# EAGLE design v1 (EAGLE 9.0.1)
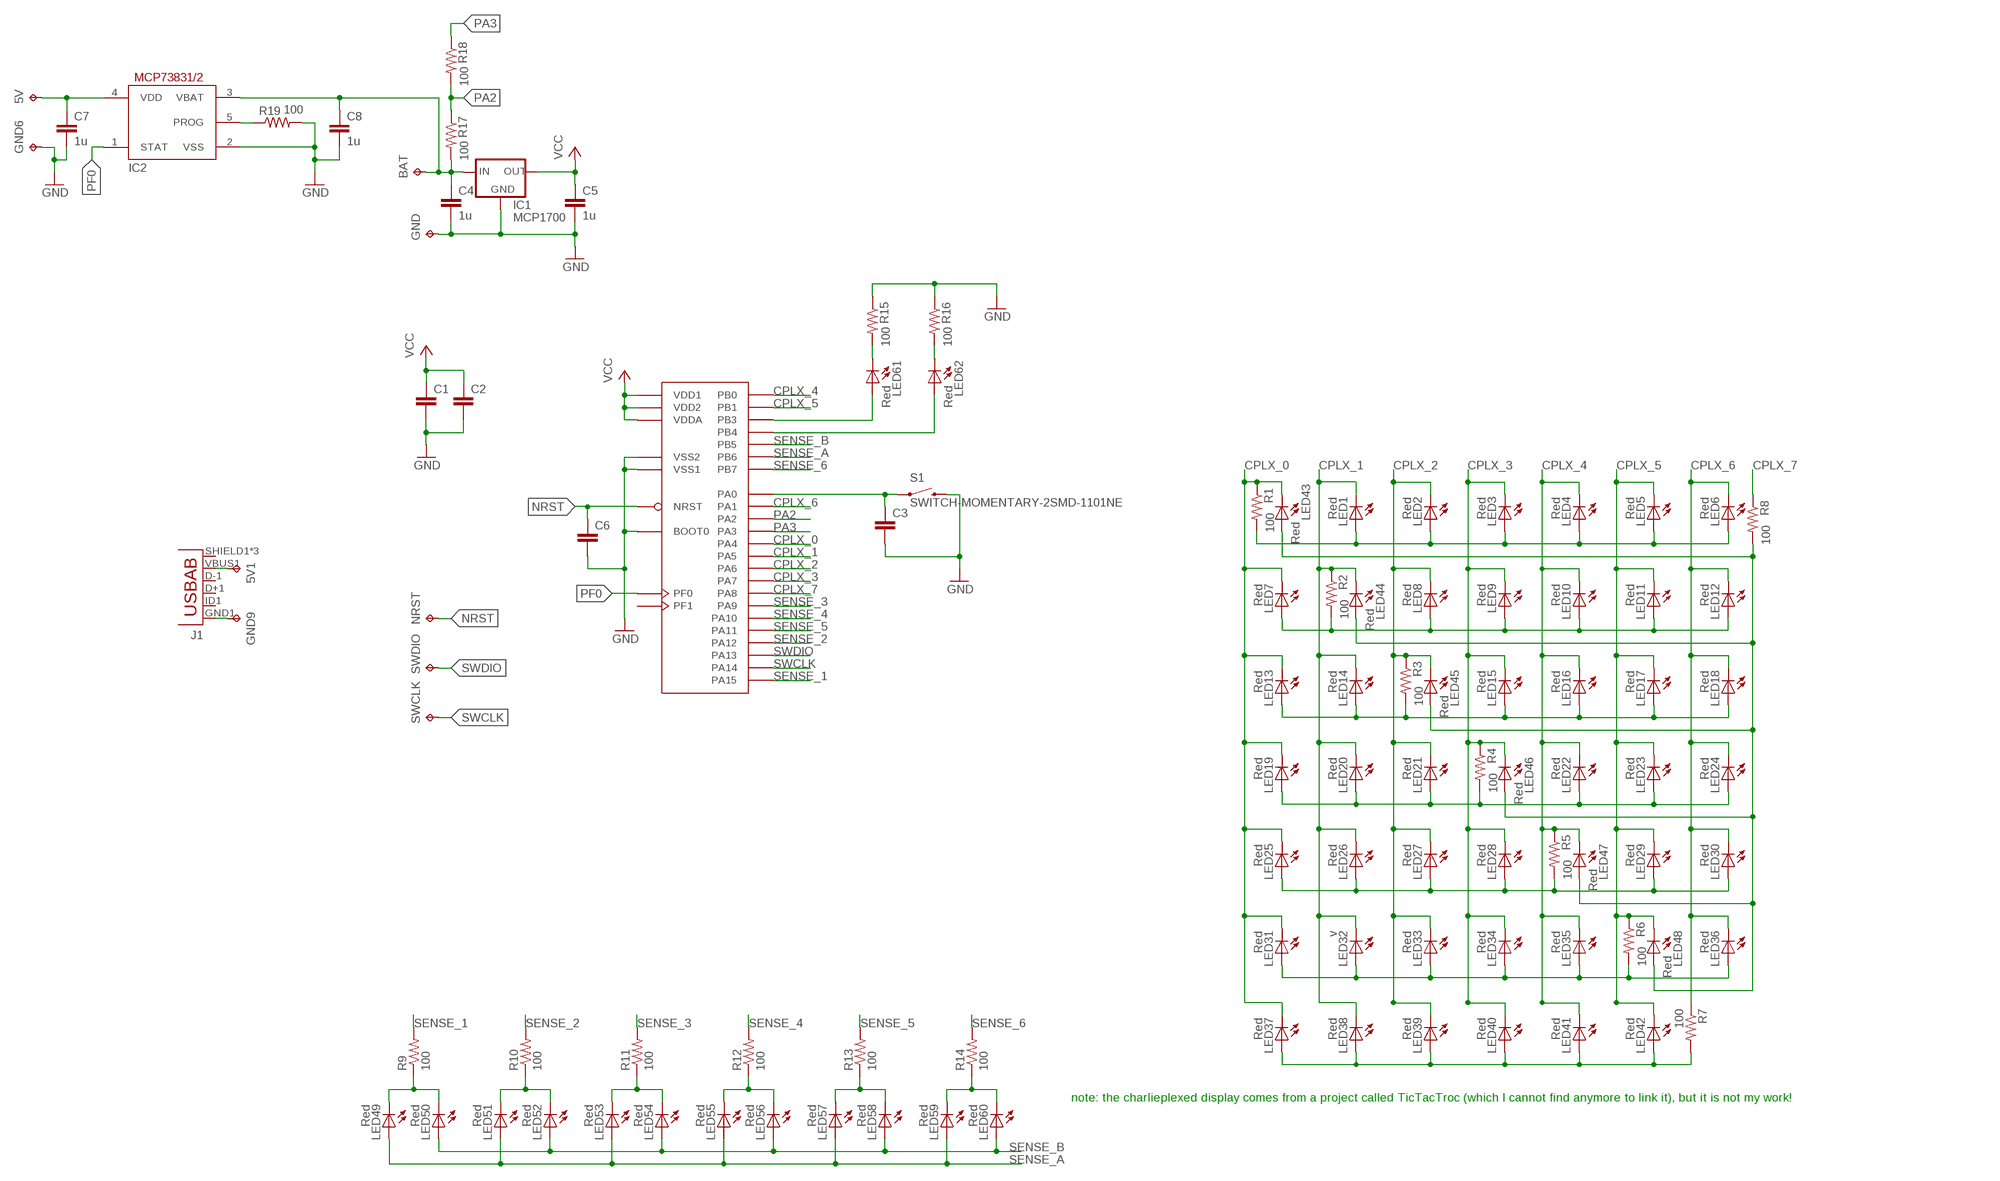
[diagram p0: schematic, sheet 1]

## Parts
5V  TPB1,27  [B1,27]
5V1  TPB1,27  [B1,27]
BAT  TPB1,27  [B1,27]
C1  C-EUC0603K  [C0603K]
C2  C-EUC0603K  [C0603K]
C3  C-EUC0603K  [C0603K]
C4  1u  C-EUC0603K  [C0603K]
C5  1u  C-EUC0603K  [C0603K]
C6  C-EUC0603K  [C0603K]
C7  1u  C-EUC0603K  [C0603K]
C8  1u  C-EUC0603K  [C0603K]
GND  TPB1,27  [B1,27]
GND6  TPB1,27  [B1,27]
GND9  TPB1,27  [B1,27]
IC1  MCP1700  XC63FPM  [SOT23]
IC2  MCP73831/OT  [SOT23-5L]
J1  USB-ABCONN-11794  [USB-AB-MICRO-SMD_V03]
LED1  Red  LED0603  [LED-0603]
LED2  Red  LED0603  [LED-0603]
LED3  Red  LED0603  [LED-0603]
LED4  Red  LED0603  [LED-0603]
LED5  Red  LED0603  [LED-0603]
LED6  Red  LED0603  [LED-0603]
LED7  Red  LED0603  [LED-0603]
LED8  Red  LED0603  [LED-0603]
LED9  Red  LED0603  [LED-0603]
LED10  Red  LED0603  [LED-0603]
LED11  Red  LED0603  [LED-0603]
LED12  Red  LED0603  [LED-0603]
LED13  Red  LED0603  [LED-0603]
LED14  Red  LED0603  [LED-0603]
LED15  Red  LED0603  [LED-0603]
LED16  Red  LED0603  [LED-0603]
LED17  Red  LED0603  [LED-0603]
LED18  Red  LED0603  [LED-0603]
LED19  Red  LED0603  [LED-0603]
LED20  Red  LED0603  [LED-0603]
LED21  Red  LED0603  [LED-0603]
LED22  Red  LED0603  [LED-0603]
LED23  Red  LED0603  [LED-0603]
LED24  Red  LED0603  [LED-0603]
LED25  Red  LED0603  [LED-0603]
LED26  Red  LED0603  [LED-0603]
LED27  Red  LED0603  [LED-0603]
LED28  Red  LED0603  [LED-0603]
LED29  Red  LED0603  [LED-0603]
LED30  Red  LED0603  [LED-0603]
LED31  Red  LED0603  [LED-0603]
LED32  v  LED0603  [LED-0603]
LED33  Red  LED0603  [LED-0603]
LED34  Red  LED0603  [LED-0603]
LED35  Red  LED0603  [LED-0603]
LED36  Red  LED0603  [LED-0603]
LED37  Red  LED0603  [LED-0603]
LED38  Red  LED0603  [LED-0603]
LED39  Red  LED0603  [LED-0603]
LED40  Red  LED0603  [LED-0603]
LED41  Red  LED0603  [LED-0603]
LED42  Red  LED0603  [LED-0603]
LED43  Red  LED0603  [LED-0603]
LED44  Red  LED0603  [LED-0603]
LED45  Red  LED0603  [LED-0603]
LED46  Red  LED0603  [LED-0603]
LED47  Red  LED0603  [LED-0603]
LED48  Red  LED0603  [LED-0603]
LED49  Red  LED0603  [LED-0603]
LED50  Red  LED0603  [LED-0603]
LED51  Red  LED0603  [LED-0603]
LED52  Red  LED0603  [LED-0603]
LED53  Red  LED0603  [LED-0603]
LED54  Red  LED0603  [LED-0603]
LED55  Red  LED0603  [LED-0603]
LED56  Red  LED0603  [LED-0603]
LED57  Red  LED0603  [LED-0603]
LED58  Red  LED0603  [LED-0603]
LED59  Red  LED0603  [LED-0603]
LED60  Red  LED0603  [LED-0603]
LED61  Red  LED0603  [LED-0603]
LED62  Red  LED0603  [LED-0603]
NRST  TPB1,27  [B1,27]
R1  100  RESISTOR0402-RES  [0402-RES]
R2  100  RESISTOR0402-RES  [0402-RES]
R3  100  RESISTOR0402-RES  [0402-RES]
R4  100  RESISTOR0402-RES  [0402-RES]
R5  100  RESISTOR0402-RES  [0402-RES]
R6  100  RESISTOR0402-RES  [0402-RES]
R7  100  RESISTOR0402-RES  [0402-RES]
R8  100  RESISTOR0402-RES  [0402-RES]
R9  100  RESISTOR0402-RES  [0402-RES]
R10  100  RESISTOR0402-RES  [0402-RES]
R11  100  RESISTOR0402-RES  [0402-RES]
R12  100  RESISTOR0402-RES  [0402-RES]
R13  100  RESISTOR0402-RES  [0402-RES]
R14  100  RESISTOR0402-RES  [0402-RES]
R15  100  RESISTOR0402-RES  [0402-RES]
R16  100  RESISTOR0402-RES  [0402-RES]
R17  100  RESISTOR0402-RES  [0402-RES]
R18  100  RESISTOR0402-RES  [0402-RES]
R19  100  RESISTOR0402-RES  [0402-RES]
S1  SWITCH-MOMENTARY-2SMD-1101NE  [TACTILE-SWITCH-1101NE]
SWCLK  TPB1,27  [B1,27]
SWDIO  TPB1,27  [B1,27]
U$1  STM32F030K6T6  [TQFP32-08]

## Nets
CPLX_0: LED7.C LED13.C LED19.C LED25.C LED31.C LED37.C LED43.C R1.1 U$1.10(PA4)
CPLX_1: LED1.C LED14.C LED20.C LED26.C LED32.C LED38.C LED44.C R2.1 U$1.11(PA5)
CPLX_2: LED2.C LED8.C LED21.C LED27.C LED33.C LED39.C LED45.C R3.1 U$1.12(PA6)
CPLX_3: LED3.C LED9.C LED15.C LED28.C LED34.C LED40.C LED46.C R4.1 U$1.13(PA7)
CPLX_4: LED4.C LED10.C LED16.C LED22.C LED35.C LED41.C LED47.C R5.1 U$1.14(PB0)
CPLX_5: LED5.C LED11.C LED17.C LED23.C LED29.C LED42.C LED48.C R6.1 U$1.15(PB1)
CPLX_6: LED6.C LED12.C LED18.C LED24.C LED30.C LED36.C R7.1 U$1.7(PA1)
CPLX_7: R8.1 U$1.18(PA8)
GND: C1.2 C2.2 C3.2 C4.2 C5.2 C6.2 C7.2 C8.2 GND6.TP GND.TP IC1.1(GND) IC2.2(VSS) R15.1 R16.1 R19.2 S1.2 U$1.16(VSS1) U$1.31(BOOT0) U$1.32(VSS2)
N$1: LED61.A U$1.26(PB3)
N$2: LED62.A U$1.27(PB4)
N$3: GND9.TP J1.GND1(GND)
N$4: C3.1 S1.1 U$1.6(PA0)
N$5: LED61.C R15.2
N$6: LED62.C R16.2
N$7: 5V1.TP J1.VBUS1(VBUS)
N$8: 5V.TP C7.1 IC2.4(VDD)
N$9: IC2.5(PROG) R19.1
N$11: BAT.TP C4.1 C8.1 IC1.3(IN) IC2.3(VBAT) R17.2
N$12: LED19.A LED20.A LED21.A LED22.A LED23.A LED24.A R4.2
N$13: LED1.A LED2.A LED3.A LED4.A LED5.A LED6.A R1.2
N$14: LED7.A LED8.A LED9.A LED10.A LED11.A LED12.A R2.2
N$15: LED25.A LED26.A LED27.A LED28.A LED29.A LED30.A R5.2
N$16: LED13.A LED14.A LED15.A LED16.A LED17.A LED18.A R3.2
N$17: LED43.A LED44.A LED45.A LED46.A LED47.A LED48.A R8.2
N$18: LED37.A LED38.A LED39.A LED40.A LED41.A LED42.A R7.2
N$19: LED31.A LED32.A LED33.A LED34.A LED35.A LED36.A R6.2
N$21: LED49.C LED50.C R9.1
N$22: LED51.C LED52.C R10.1
N$23: LED53.C LED54.C R11.1
N$24: LED55.C LED56.C R12.1
N$25: LED57.C LED58.C R13.1
N$26: LED59.C LED60.C R14.1
NRST: C6.1 NRST.TP U$1.4(NRST)
PA2: R17.1 R18.2 U$1.8(PA2)
PA3: R18.1 U$1.9(PA3)
PF0: IC2.1(STAT) U$1.2(PF0)
SENSE_1: R9.2 U$1.25(PA15)
SENSE_2: R10.2 U$1.22(PA12)
SENSE_3: R11.2 U$1.19(PA9)
SENSE_4: R12.2 U$1.20(PA10)
SENSE_5: R13.2 U$1.21(PA11)
SENSE_6: R14.2 U$1.30(PB7)
SENSE_A: LED49.A LED51.A LED53.A LED55.A LED57.A LED59.A U$1.29(PB6)
SENSE_B: LED50.A LED52.A LED54.A LED56.A LED58.A LED60.A U$1.28(PB5)
SWCLK: SWCLK.TP U$1.24(PA14)
SWDIO: SWDIO.TP U$1.23(PA13)
VCC: C1.1 C2.1 C5.1 IC1.2(OUT) U$1.1(VDD1) U$1.5(VDDA) U$1.17(VDD2)
Unconnected: J1.D+1(D+) J1.D-1(D-) J1.ID1(USBID) J1.SHIELD1(SHIELD) J1.SHIELD2(SHIELD) J1.SHIELD3(SHIELD) U$1.3(PF1)

## Notes on the sheet
- note: the charlieplexed display comes from a project called TicTacTroc (which I cannot find anymore to link it), but it is not my work!

## Library data of the parts
5V 5V1 BAT GND GND6 GND9 NRST SWCLK SWDIO = testpad:TP: Test pad
C1-C8 = resistor:C-EU: CAPACITOR, European symbol
IC1 = v-reg:XC63FP: Positiv Voltage Regulators www.torex.co.jp/english/product/pro02/pdf/0201_xc62fp.pdf
IC2 = adafruit:MCP73831: MCP73831/2 Miniature Single-Cell, Fully Integrated Li-Ion, Li-Polymer Charge Management Controllers. Nice and small simple lipoly charge controller, with adjustable current and status output (LED) http://www.ladyada.net/library/pcb/eaglelibrary.html
J1 = SparkFun-Connectors:USB-AB: This is a USB AB connector that is compatible with USB OTG. i.e. this connector can serve as a host or device; PROD_ID: CONN-11794
LED1-LED62 = SparkFun:LED: LEDs Standard schematic elements and footprints for 5mm, 3mm, 1206, and 0603 sized LEDs. 5mm - Spark Fun Electronics SKU : COM-00529 (and others)
R1-R19 = SparkFun:RESISTOR: Resistor Basic schematic elements and footprints for 0603, 1206, and PTH resistors.
S1 = SparkFun-Electromechanical:SWITCH-MOMENTARY-2: Various NO switches- pushbuttons, reed, etc; PROD_ID: SWCH-00815
U$1 = SparkFun-DigitalIC:STM32F030K6T6

## Board
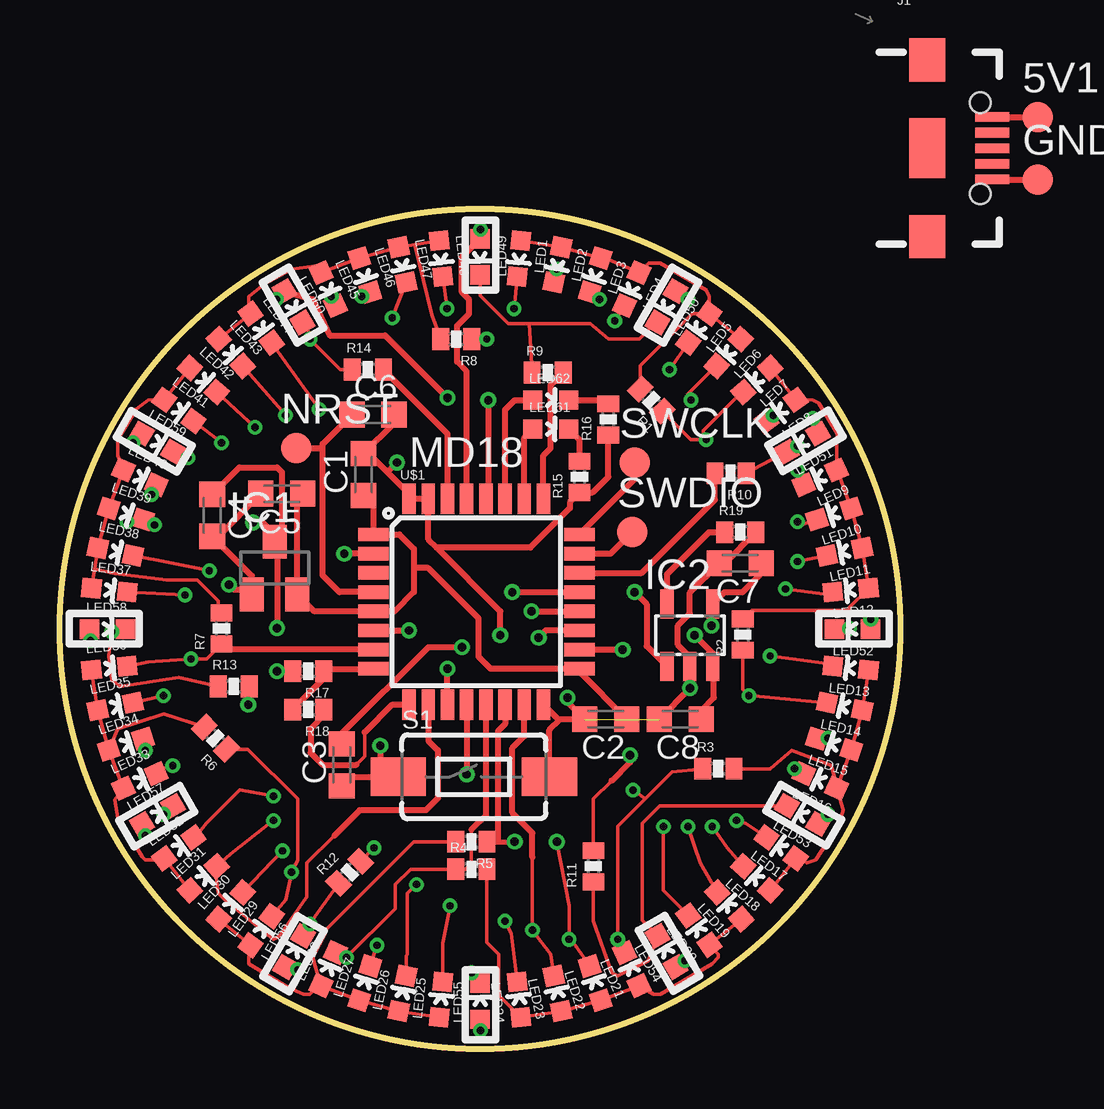
[diagram p1: board, top side]
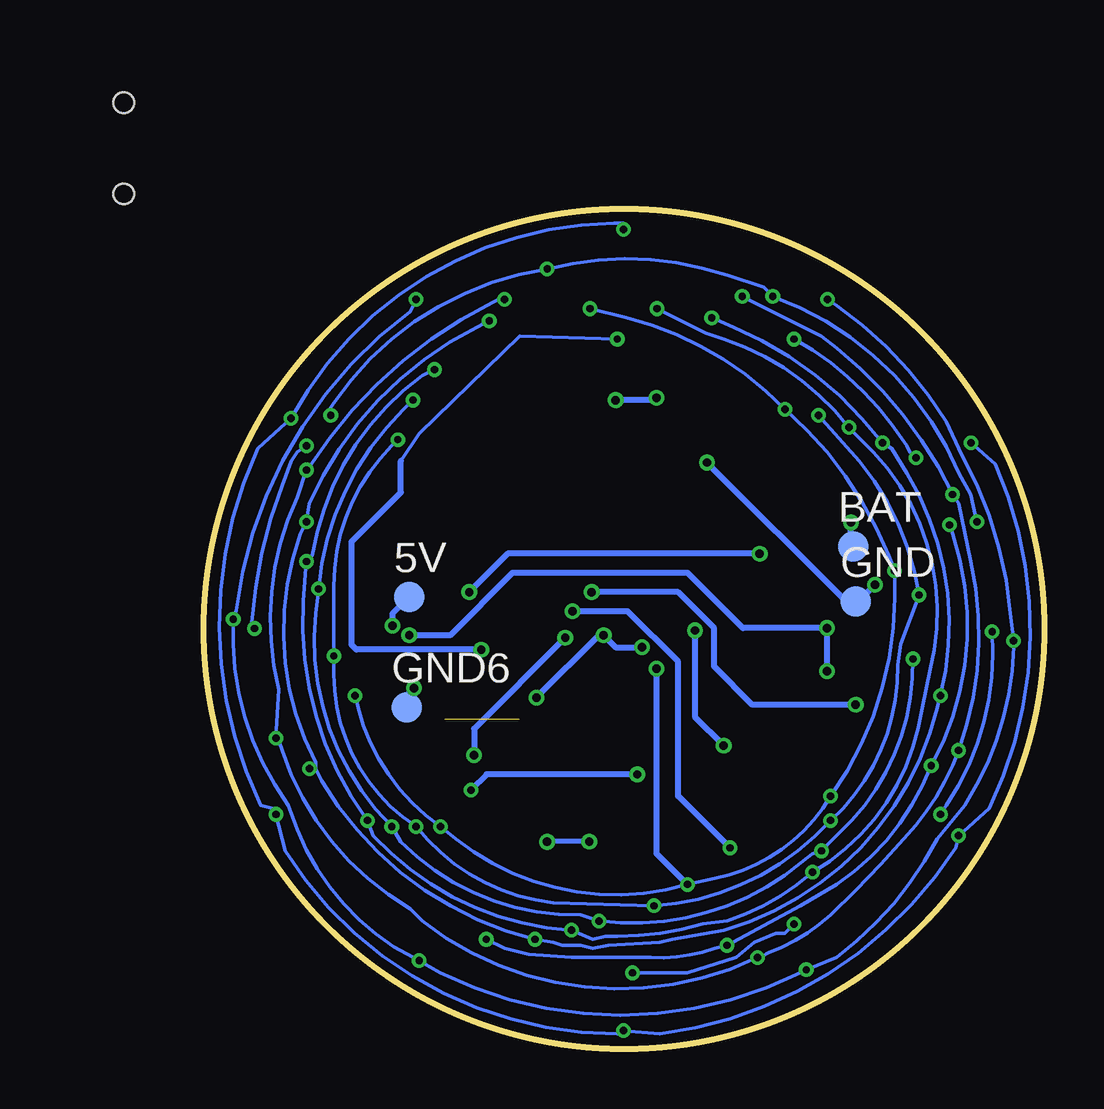
[diagram p2: board, bottom side, seen from below]

Size 35 x 35 mm. Coordinates in mm from the lower left corner, seen from the top.
Outline: circle at 17.5,17.5 radius 17.5
Copper layers (1*16): Top 0.035mm / dielectric 1.5mm / Bottom 0.035mm
Design rules "default": minimum track width 6mil, minimum drill 12mil, track to track 6mil, track to pad 6mil, pad to pad 6mil, via to via 6mil, smd to smd 0mil, copper to edge 10mil, drill to drill 10mil, minimum pad ring 10mil, minimum via ring 6mil, stop-mask expansion 2mil, vias tented up to drill 100mil, thermal gap 10mil

### Footprints (pad centres in the part's own frame; a part is rotated, then mirrored left to right if it is on the bottom)
B1,27 = smd 1.27 x 1.27: TP 0,0
C0603K = smd 1.05 x 1.08: 1 -0.875,0; 2 0.875,0
SOT23 = smd 1 x 1.4: 1 -0.95,-1.1; 2 0.95,-1.1; 3 0,1.1
SOT23-5L = smd 0.55 x 1.2: 1 -0.95,-1.3; 2 0,-1.3; 3 0.95,-1.3; 4 0.95,1.3; 5 -0.95,1.3
USB-AB-MICRO-SMD_V03 = smd 1.4 x 0.4: D+1 2.7,0; D-1 2.7,0.65; GND1 2.7,-1.3; ID1 2.7,-0.65; VBUS1 2.7,1.3 | smd 1.5 x 1.8: SHIELD1 0,3.68; SHIELD3 0,-3.68 | smd 1.5 x 2.5: SHIELD2 0,0 | hole 0.85: 2.2,1.9; 2.2,-1.9
LED-0603 = smd 0.8 x 0.8: A 0,-0.75; C 0,0.75
0402-RES = smd 0.7 x 0.9: 1 -0.65,0; 2 0.65,0
TACTILE-SWITCH-1101NE = smd 2.3 x 1.6: 1 -3.15,0; 2 3.15,0
TQFP32-08 = smd 1.27 x 0.559: 1 -4.293,2.8; 2 -4.293,2; 3 -4.293,1.2; 4 -4.293,0.4; 5 -4.293,-0.4; 6 -4.293,-1.2; 7 -4.293,-2; 8 -4.293,-2.8; 17 4.293,-2.8; 18 4.293,-2; 19 4.293,-1.2; 20 4.293,-0.4; 21 4.293,0.4; 22 4.293,1.2; 23 4.293,2; 24 4.293,2.8 | smd 0.559 x 1.27: 9 -2.8,-4.293; 10 -2,-4.293; 11 -1.2,-4.293; 12 -0.4,-4.293; 13 0.4,-4.293; 14 1.2,-4.293; 15 2,-4.293; 16 2.8,-4.293; 25 2.8,4.293; 26 2,4.293; 27 1.2,4.293; 28 0.4,4.293; 29 -0.4,4.293; 30 -1.2,4.293; 31 -2,4.293; 32 -2.8,4.293

### Placement (x,y rotation side)
5V  26.45,18.85 0 bottom
5V1  40.75,38.85 0 top  (outside the outline)
BAT  7.95,20.95 0 bottom
C1  12.65,23.95 90 top
C2  22.75,13.75 180 top
C3  11.75,11.85 90 top
C4  6.35,22.25 270 top
C5  9.25,23.15 180 top
C6  13.05,26.45 0 top
C7  28.35,20.25 180 top
C8  25.85,13.75 180 top
GND  7.85,18.65 0 bottom
GND6  26.55,14.25 0 bottom
GND9  40.75,36.25 0 top  (outside the outline)
IC1  8.95,20.05 0 top
IC2  26.25,17.25 0 top
J1  36.15,37.55 0 top
LED1  19.13,32.94 174 top
LED2  20.73,32.69 168 top
LED3  22.3,32.26 162 top
LED4  23.82,31.67 156 top
LED5  26.62,30.05 144 top
LED6  27.86,29.03 138 top
LED7  29.03,27.89 132 top
LED8  30.05,26.62 126 top
LED9  31.67,23.82 114 top
LED10  32.26,22.3 108 top
LED11  32.69,20.73 102 top
LED12  32.94,19.13 96 top
LED13  32.94,15.87 84 top
LED14  32.69,14.27 78 top
LED15  32.26,12.7 72 top
LED16  31.67,11.18 66 top
LED17  30.05,8.38 54 top
LED18  29.03,7.11 48 top
LED19  27.89,5.97 42 top
LED20  26.62,4.95 36 top
LED21  23.82,3.33 24 top
LED22  22.3,2.74 18 top
LED23  20.73,2.31 12 top
LED24  19.13,2.06 6 top
LED25  15.87,2.06 354 top
LED26  14.27,2.31 348 top
LED27  12.7,2.74 342 top
LED28  11.18,3.33 336 top
LED29  8.38,4.93 324 top
LED30  7.11,5.97 318 top
LED31  5.97,7.11 312 top
LED32  4.95,8.38 306 top
LED33  3.33,11.18 294 top
LED34  2.74,12.7 288 top
LED35  2.31,14.27 282 top
LED36  2.06,15.87 276 top
LED37  2.06,19.13 264 top
LED38  2.31,20.73 258 top
LED39  2.74,22.3 252 top
LED40  3.33,23.82 246 top
LED41  4.95,26.62 234 top
LED42  5.97,27.89 228 top
LED43  7.11,29.03 222 top
LED44  8.38,30.05 216 top
LED45  11.18,31.67 204 top
LED46  12.7,32.26 198 top
LED47  14.27,32.69 192 top
LED48  15.87,32.94 186 top
LED49  17.5,33.02 180 top
LED50  25.27,30.94 150 top
LED51  30.94,25.27 120 top
LED52  33.02,17.5 90 top
LED53  30.94,9.75 60 top
LED54  25.27,4.06 30 top
LED55  17.5,1.98 0 top
LED56  9.75,4.06 330 top
LED57  4.06,9.75 300 top
LED58  1.98,17.5 270 top
LED59  4.06,25.27 240 top
LED60  9.73,30.94 210 top
LED61  20.45,25.85 270 top
LED62  20.45,27.05 270 top
NRST  9.85,25.05 0 top
R1  24.64,27.05 135 top
R2  28.45,17.27 90 top
R3  27.43,11.68 0 top
R4  17.14,7.49 0 top
R5  17.14,8.64 180 top
R6  6.48,12.95 135 top
R7  6.73,17.53 90 top
R8  16.51,29.59 180 top
R9  20.32,28.19 0 top
R10  27.94,24 180 top
R11  22.22,7.62 90 top
R12  12.06,7.37 45 top
R13  7.24,15.11 0 top
R14  12.83,28.32 0 top
R15  21.65,23.85 90 top
R16  22.85,26.25 90 top
R17  10.35,15.75 180 top
R18  10.35,14.15 180 top
R19  28.35,21.55 0 top
S1  17.25,11.35 0 top
SWCLK  23.95,24.45 0 top
SWDIO  23.85,21.55 0 top
U$1  17.35,18.65 0 top

### Tracks (layer width: path | path; a pad name or v marks a point on that pad's centre or on a via)
CPLX_0  (via drill 0.3)
  Top 0.152: LED7.C 28.4,27.39 26.8,25.78 26.8,25.53 v26.92,25.4 26.29,25.4 R1.1 | v29.59,16.38 32.38,16 32.26,16 LED13.C | v26.16,9.27 26.67,7.75 LED19.C | LED25.C 15.95,4.4 v16.26,5.97 | v8.89,9.52 7.11,8.13 LED31.C 6.48,7.49 6.6,6.48 6.86,6.22 8.89,4.57 9.14,4.7 10.29,6.35 10.29,7.75 11.43,8.89 | LED37.C v5.21,18.92 | LED43.C v9.4,26.42
  Top 0.254: U$1.10 15.35,12.85 15.75,12.45 15.75,10.45 15.25,9.95 12.49,9.95 11.43,8.89
  Bottom 0.152: v26.92,25.4 27.18,25.15 arc-45 29.59,19.3 v29.59,16.38 29.59,15.62 arc-57 v26.16,9.27 arc-46 20.45,6.1 v16.26,5.97 arc-44 v8.89,9.52 arc-49 6.1,16 5.97,16.89 v5.21,18.92 arc-36 8.38,25.27 v9.4,26.42
CPLX_1  (via drill 0.3, 0.35)
  Top 0.152: LED14.C v28.7,14.73 28.45,14.99 R2.1 | v25.15,9.27 25.15,6.6 26.18,5.57 LED20.C | v14.86,6.86 14.48,6.48 14.48,3.94 14.43,3.89 LED26.C | v8.89,10.54 7.49,10.79 6.1,9.4 5.59,8.76 | 5.59,8.76 5.59,8.89 | 5.59,8.76 LED32.C | LED38.C v6.22,19.94 | v10.79,26.67 8.89,29.34 | 8.89,29.34 8.89,29.46 | LED44.C 8.89,29.34 | LED1.C v18.92,30.86
  Top 0.254: U$1.11 v16.15,15.85
  Bottom 0.152: v28.7,14.73 28.57,14.22 arc-41 v25.15,9.27 24.51,8.76 arc-55 v14.86,6.86 13.72,7.11 arc-48 v8.89,10.54 arc-35 6.22,18.8 v6.22,19.94 6.48,20.57 arc-27 v10.79,26.67 arc-32 17.4,30.48 v18.92,30.86
  Bottom 0.254: v16.15,15.85 16.15,8.14 v14.86,6.86
CPLX_2  (via drill 0.3, 0.35)
  Top 0.152: LED27.C v13.21,4.32 | v4.7,11.81 4.7,11.94 3.94,11.43 LED33.C 4.08,11.53 | LED21.C v23.24,4.57 23.24,9.27 24.38,10.41 | LED39.C v3.94,21.84 v2.79,21.97 | LED8.C v29.72,26.42 | v20.7,32.51 20.83,32.51 20.57,32 LED2.C | LED45.C v11.3,31.37 | 24.38,10.41 25.51,11.56 R3.1 | 23.88,10.92 v23.88,10.79 24.38,10.41
  Top 0.254: U$1.12 v16.95,11.45
  Bottom 0.152: v23.24,4.57 22.48,4.19 21.46,3.94 19.68,3.81 16.38,3.81 arc-21 13.72,4.19 v13.21,4.32 10.16,5.97 8.64,6.86 arc-35 v4.7,11.81 arc-47 3.81,21.46 v3.94,21.84 | v29.72,26.42 29.84,26.54 29.59,26.92 arc47 v20.7,32.51 arc33 13.21,32.26 11.68,31.75 v11.3,31.37 arc47 3.56,24 3.05,23.11 v2.79,21.97
  Bottom 0.254: v16.95,11.45 23.22,11.45 v23.88,10.79
CPLX_3  (via drill 0.3)
  Top 0.152: LED3.C 22.22,31.24 v22.48,31.24 | v30.73,24.13 30.73,24 LED9.C | LED15.C v32,12.95 | LED28.C v11.94,3.81 13.97,5.84 13.97,6.86 14.6,7.49 R4.1 16.89,7.49 17.14,7.75 17.14,9.14 | LED34.C v3.56,12.45 | LED40.C v3.81,23.11 | LED46.C v12.57,31.37
  Top 0.254: U$1.13 17.75,9.74 17.14,9.14
  Bottom 0.152: v22.48,31.24 22.73,31.24 22.99,31.11 arc-31 30.61,24.26 v30.73,24.13 31.11,22.99 arc-39 31.88,14.99 v32,12.95 32,13.21 31.75,12.45 arc-41 26.42,5.84 25.91,5.33 arc-64 v11.94,3.81 arc-22 LED28.C arc-22 8.89,5.59 arc-6 5.84,8.76 arc-20 3.81,11.81 v3.56,12.45 arc-32 3.05,20.32 3.56,22.73 v3.81,23.11 arc-26 8.64,29.21 9.27,29.72 v12.57,31.37
CPLX_4  (via drill 0.3, 0.35)
  Top 0.152: LED4.C v23.11,30.35 | v30.73,21.97 30.86,21.84 LED10.C | LED16.C 30.99,11.68 v30.61,11.68 | LED22.C 21.46,4.32 v21.21,4.57 21.21,5.97 v20.7,8.64 | LED35.C v4.32,14.73 | LED41.C v6.73,25.27 | LED47.C v13.84,30.48 | 18.25,8.64 R5.1
  Top 0.2: R5.1 v18.94,8.64 v18.95,8.65
  Top 0.254: U$1.14 18.55,13.55 18.25,13.25 18.25,8.64
  Bottom 0.152: v23.11,30.35 23.62,30.1 arc-40 30.61,22.73 v30.73,21.97 30.99,21.46 arc-47 30.35,11.94 30.35,11.68 | v30.61,11.68 30.35,11.68 | 30.35,11.68 30.1,11.18 arc-45 v21.21,4.57 20.45,4.44 20.07,4.32 19.3,4.32 18.8,4.19 18.16,4.32 16,4.44 15.49,4.57 13.33,4.95 arc-60 4.44,14.22 v4.32,14.73 arc-45 5.71,24 6.35,25.02 v6.73,25.27 arc-29 12.95,30.1 v13.84,30.48
  Bottom 0.2: v18.95,8.65 v20.69,8.65 v20.7,8.64
CPLX_5  (via drill 0.3)
  Top 0.152: LED5.C v25.4,28.32 | v28.19,9.52 28.57,9.4 LED17.C | v30.73,20.32 LED11.C | LED23.C 20.45,3.94 v19.68,4.95 19.68,8 | LED29.C 9.4,6.22 v9.65,7.37 9.91,7.87 9.91,10.41 7.83,12.49 R6.1 | LED42.C v8.13,25.91 | LED48.C v16.13,30.86
  Top 0.254: 19.68,8 19.68,9.01 18.85,9.85 18.85,12.55 19.35,13.05 U$1.15
  Bottom 0.152: v25.4,28.32 25.91,28.07 arc-45 30.48,20.57 v30.73,20.32 30.86,18.67 arc-40 v28.19,9.52 27.94,8.89 arc-44 v19.68,4.95 18.8,4.57 18.29,4.7 17.78,4.7 arc-16 14.22,5.21 13.21,5.33 arc-23 v9.65,7.37 arc-52 5.08,14.22 arc-2 4.57,16.64 arc-53 7.11,24.89 v8.13,25.91 arc-34 13.33,29.59 14.1,29.84 v16.13,30.86
CPLX_6  (via drill 0.3)
  Top 0.152: LED6.C 27.33,28.47 26.16,27.3 26.16,27.18 v26.29,27.05 | 32.07,18.92 LED12.C 32.13,18.92 v30.23,19.18 | v27.18,9.27 27.81,8.38 LED18.C | v18.54,5.33 18.8,4.83 18.92,3.81 LED24.C | LED30.C v9.27,8.25 | LED36.C 3.68,16.13 v5.46,16.26 6.11,16.26 R7.1
  Top 0.254: U$1.7 6.96,16.65 R7.1
  Bottom 0.152: v26.29,27.05 26.67,26.67 arc-41 v30.23,19.18 30.35,18.16 arc-51 v27.18,9.27 26.8,8.64 arc-46 19.3,5.59 v18.54,5.33 arc-42 10.79,7.24 9.65,8.13 v9.27,8.25 8,9.52 arc-43 v5.46,16.26
CPLX_7  (via drill 0.3, 0.35)
  Top 0.152: R8.1 v17.78,29.59
  Top 0.254: U$1.18 v23.45,16.65
  Bottom 0.152: v17.78,29.59 21.84,29.72 26.03,25.65 26.8,24.51
  Bottom 0.254: v23.45,16.65 28.65,16.65 28.85,16.85 28.85,21.15 26.8,23.19 26.8,24.51
GND  (via drill 0.35)  (1 unrouted)
  Top 0.254: U$1.32 14.75,22.94 | 14.75,22.94 U$1.31 15.35,21.25 15.7,20.9 | 13.64,24.04 12.86,24.82 C1.2 13.92,26.1 C6.2 | 13.64,24.04 14.75,22.94 | 20.85,13.75 C2.2 21.15,14.47 v21.15,14.65 | 20.85,13.75 20.75,13.75 U$1.16 | S1.2 20.4,13.3 20.85,13.75 | v18.35,17.25 18.35,18.25 15.7,20.9 | v16.75,16.75 15.35,16.75 11.75,13.15 C3.2 | IC1.1 8,19.15 | 8,19.15 8,19.72 C4.2 6.6,21.37 C5.2 | v7.05,19.35 7.25,19.15 8,19.15 | R16.1 22.85,23.85 22.2,23.2 R15.1 21.25,22.8 21.25,22.55 19.6,20.9 15.7,20.9 | R19.2 27.7,20.25 C7.2 26.25,19.02 26.25,18.15 25.75,17.65 25.75,16.85 26.25,16.35 IC2.2 v26.25,15.05 26.25,15.02 C8.2 | v14.05,24.45 13.64,24.04
  Bottom 0.254: v21.15,14.65 18.55,17.25 v18.35,17.25 17.85,16.75 v16.75,16.75 | v7.05,19.35 7.75,18.65 GND.TP 8.25,18.65 v14.05,24.45 | GND6.TP 26.55,14.75 v26.25,15.05
N$1
  Top 0.254: U$1.26 19.35,25.5 LED61.A
N$2
  Top 0.254: U$1.27 18.55,26.65 18.95,27.05 LED62.A
N$3
  Top 0.254: J1.GND1 GND9.TP
N$4  (via drill 0.35)
  Top 0.254: U$1.6 v14.55,17.45 | v13.35,12.65 13.35,12.1 S1.1 12.12,11.35 C3.1
  Bottom 0.254: v14.55,17.45 14.55,13.85 v13.35,12.65
N$5
  Top 0.254: LED61.C 21.65,25.4 R15.2
N$6
  Top 0.254: LED62.C 22.7,27.05 R16.2
N$7
  Top 0.254: J1.VBUS1 5V1.TP
N$8  (via drill 0.35)
  Top 0.254: C7.1 29.22,19.82 28.45,19.05 27.7,19.05 IC2.4 27.15,18.5 v27.15,17.65
  Bottom 0.254: 5V.TP 27.15,18.15 v27.15,17.65
N$9
  Top 0.254: IC2.5 25.3,19.8 27.05,21.55 R19.1
N$11  (via drill 0.35)
  Top 0.254: C4.1 7.47,24.25 9.05,24.25 9.25,24.05 9.25,21.45 9.1,21.3 | 9.1,21.3 IC1.3 9.05,21.05 v9.05,17.55 | v8.05,21.95 8.45,21.95 9.1,21.3 | v9.05,15.75 R17.2 | C8.1 26.72,14.12 27.25,14.65 27.25,15.9 IC2.3 27.2,16.5 v26.45,17.25
  Bottom 0.254: BAT.TP 8.05,21.05 v8.05,21.95 | v9.05,15.75 v9.05,17.55 12.55,17.55 14.85,19.85 22.15,19.85 24.75,17.25 v26.45,17.25
N$12
  Top 0.152: LED19.A LED20.A 27.06,4.31 27.43,3.94 27.43,3.81 27.18,3.56 25.02,2.29 24.74,2.29 LED21.A LED22.A LED23.A LED24.A 18.29,2.23 18.29,3.94 17.78,4.44 17.78,7.48 | 17.78,7.48 17.78,7.49 | R4.2 17.78,7.48
N$13
  Top 0.152: LED1.A LED2.A LED3.A 22.73,33.02 22.61,32.89 22.86,32.89 LED4.A | LED5.A LED6.A | LED4.A 24.1,32.38 24,32.38 | LED4.A 24.54,32.77 25.02,32.77 26.92,31.62 27.06,31.36 LED5.A | LED5.A 26.34,30.65 24.18,28.5 R1.2
N$14
  Top 0.152: LED7.A LED8.A 30.74,27.06 31.37,27.05 31.62,26.92 32.38,25.65 32.36,25.12 LED9.A 32.38,24.13 LED10.A LED11.A LED12.A 32.89,18.41 32.89,18.29 28.81,18.29 R2.2
N$15
  Top 0.152: LED25.A LED26.A LED27.A LED28.A | LED30.A LED29.A 7.94,4 7.87,3.81 7.87,3.56 9.52,2.54 10.16,2.29 10.41,2.29 10.77,2.64 LED28.A | R5.2 14.73,8.64 11.05,4.95 11.05,4.83 10.54,3.81 LED28.A
N$16
  Top 0.152: LED13.A LED14.A LED15.A LED16.A | LED18.A LED17.A 30.92,7.94 31.11,7.75 31.5,7.87 32.13,8.89 32.51,9.52 32.64,9.96 LED16.A | R3.2 29.59,11.68 30.48,12.45 32.13,11.81 32.38,10.92 | 32.26,10.92 32.38,10.92 | 32.38,10.92 32.38,10.79 LED16.A
N$17
  Top 0.152: LED43.A LED44.A 7.87,30.72 7.87,31.37 8.51,31.88 9.65,32.51 10.59,32.64 LED45.A LED46.A LED47.A 14.79,33.53 | 14.79,33.53 LED48.A | R8.2 15.49,30.61 14.79,33.53
N$18
  Top 0.152: LED37.A 1.44,20.01 | 1.44,20.01 LED38.A LED39.A LED40.A 2.41,24.74 2.41,25.4 3.17,26.67 3.68,27.05 3.93,27.06 LED41.A LED42.A | R7.2 6.6,18.3 6.6,18.67 5.71,19.56 4.44,19.56 2.29,19.81 1.44,20.01
N$19
  Top 0.152: LED31.A LED32.A 4,7.94 3.94,7.87 3.56,7.87 3.43,8 3.05,8.64 2.41,9.65 2.29,10.39 LED33.A LED34.A | LED34.A LED35.A LED36.A | LED34.A 2.41,13.33 4.32,13.97 R6.2
N$21
  Top 0.152: 17.4,32 17.4,32.17 LED49.C 17.5,31.39 18.67,30.23 19.56,30.23 | 19.56,30.23 22.1,30.23 22.86,29.59 24.13,29.59 24.83,30.29 | 24.83,30.29 24.89,30.35 | LED50.C 24.83,30.29 | R9.1 19.56,30.23
N$22  (via drill 0.3)
  Top 0.152: v30.73,25.15 LED51.C R10.1 | v32.89,17.53 32.89,17.65 LED52.C
  Bottom 0.152: v30.73,25.15 31.11,24.89 31.37,24.51 31.75,23.49 arc-16 33.02,17.78 v32.89,17.53
N$23
  Top 0.152: LED53.C 24.99,10.13 24.26,9.4 24.26,5.35 LED54.C 24.51,3.68 23.24,3.05 22.99,3.17 22.22,5.33 R11.1
N$24  (via drill 0.3)
  Top 0.152: LED56.C v10.41,5.21 R12.1 | v17.14,3.17 17.27,2.92 LED55.C
  Bottom 0.152: v10.41,5.21 10.79,4.83 11.18,4.83 12.06,4.44 12.83,3.81 14.86,3.17 v17.14,3.17
N$25  (via drill 0.3)
  Top 0.152: 4.95,10.03 4.86,10.13 LED57.C v4.32,9.78 | LED58.C 2.67,17.53 2.16,17.53 v2.16,17.4 2.03,16.38 2.16,15.37 2.54,15.11 4.95,15.49 R13.1
  Bottom 0.152: v4.32,9.78 4.06,10.16 arc-38 v2.16,17.4
N$26  (via drill 0.3)
  Top 0.152: LED59.C 4.82,24.9 v5.33,24.64 | LED60.C 10.41,29.84 v10.41,29.59 11.68,28.32 R14.1
  Bottom 0.152: v5.33,24.64 5.59,24.89 5.71,25.15 6.35,26.03 arc-25 v10.41,29.59
NRST
  Top 0.254: U$1.4 11.65,19.05 10.95,19.75 10.95,25.05 | 10.95,25.05 10.95,25.22 C6.1 | NRST.TP 10.95,25.05
PA2
  Top 0.254: U$1.8 11.1,15.85 R17.1 11,15.45 R18.2
PA3
  Top 0.152: 12.35,11.85 12.7,12.2 12.7,13.2
  Top 0.254: R18.1 11,13.9 10.45,13.35 10.45,12.35 10.95,11.85 12.35,11.85 | U$1.9 13.85,14.35 12.7,13.2
PF0  (via drill 0.35)
  Top 0.254: U$1.2 v11.85,20.65 | v23.95,19.05 24.45,18.55 24.45,16.8 IC2.1
  Bottom 0.254: v11.85,20.65 22.35,20.65 v23.95,19.05
SENSE_1
  Top 0.254: U$1.25 20.15,24.75 20.45,25.05 20.45,27.67 R9.2
SENSE_2
  Top 0.254: U$1.22 24.25,19.85 27.29,22.89 R10.2
SENSE_3  (via drill 0.35)
  Top 0.152: 22.99,11.18 22.22,10.41 R11.2
  Top 0.254: 22.99,11.18 23.75,11.93 v23.75,12.25 | U$1.19 20.25,17.45 v19.95,17.15
  Bottom 0.254: v19.95,17.15 23.75,13.35 v23.75,12.25
SENSE_4  (via drill 0.3, 0.35)
  Top 0.152: R12.2 v13.08,8.38
  Top 0.254: v19.65,18.25 U$1.20
  Bottom 0.254: v13.08,8.38 15.25,10.55 15.25,16.15 17.35,18.25 v19.65,18.25
SENSE_5  (via drill 0.35)
  Top 0.254: R13.2 7.89,14.39 v7.85,14.35 | v18.85,19.05 U$1.21
  Bottom 0.254: v7.85,14.35 12.15,14.35 13.75,15.95 13.75,17.55 15.25,19.05 v18.85,19.05
SENSE_6
  Top 0.254: R14.2 16.15,25.65 U$1.30
SENSE_A  (via drill 0.3)
  Top 0.152: LED49.A v17.53,34.16 | v31.37,26.29 LED51.A | LED53.A v32,9.78 | LED55.A v17.53,0.76 | LED57.A v3.56,8.89 | LED59.A 3.56,25.53 v3.05,25.27
  Top 0.254: U$1.29 16.95,28.25 16.55,28.65 16.55,30.15 17.05,30.65 17.05,31.25 16.75,31.55 16.75,33.01 LED49.A
  Bottom 0.152: v17.53,34.16 17.53,34.42 17.91,34.42 arc-61 v31.37,26.29 32.77,25.02 arc-50 32.64,10.16 32.13,10.03 v32,9.78 31.62,8.25 arc-58 17.78,0.63 17.53,0.63 v17.53,0.76 16,0.63 arc-50 3.68,8.38 v3.56,8.89 2.29,10.03 arc-50 2.03,24.38 v3.05,25.27
SENSE_B  (via drill 0.3, 0.35)
  Top 0.152: LED50.A v26.16,31.24 | v33.78,17.91 LED52.A | LED54.A v26.03,3.68 | LED56.A v9.91,3.3 | LED58.A v1.27,17.02 | LED60.A 9.4,31.62 v9.02,31.24
  Top 0.254: LED60.A 10.55,31.25 11.25,29.75 13.55,29.75 v16.15,27.15 | v17.85,27.05 17.85,23.04 U$1.28
  Bottom 0.152: v26.16,31.24 26.42,30.73 arc-46 33.65,18.29 v33.78,17.91 arc-39 31.5,10.16 31.11,9.14 arc-41 26.29,3.81 v26.03,3.68 25.15,3.17 arc-53 10.16,3.17 v9.91,3.3 8.64,3.81 arc-25 4.44,8.76 3.3,10.16 arc-32 1.27,16.76 v1.27,17.02 1.4,18.16 arc-24 3.43,24.76 4.06,26.16 arc-23 8.64,30.99 v9.02,31.24
  Bottom 0.254: v16.15,27.15 16.25,27.05 v17.85,27.05
SWCLK
  Top 0.254: U$1.24 23.95,23.75 SWCLK.TP
SWDIO
  Top 0.254: U$1.23 22.95,20.65 SWDIO.TP
VCC
  Top 0.254: C1.1 13.05,22.66 U$1.1 14.15,21.45 14.75,20.85 14.75,20.05 | 14.75,20.05 14.75,19.05 13.95,18.25 U$1.5 10.6,18.25 IC1.2 9.9,22.92 C5.1 | C2.1 21.64,15.73 U$1.17 17.95,15.85 17.45,16.35 17.45,17.95 15.35,20.05 14.75,20.05

### Text on the board
tPlace: MD18